# Altium schematic sheet ep4ce30_b.SchDoc: EP4CE30F23 - B
size OrCAD B; CheckedBy: liuchao; DrawnBy: liuchao; DocumentNumber: APEX-USB2; Revision: 3.0.0; SheetNumber: 2; SheetTotal: 9
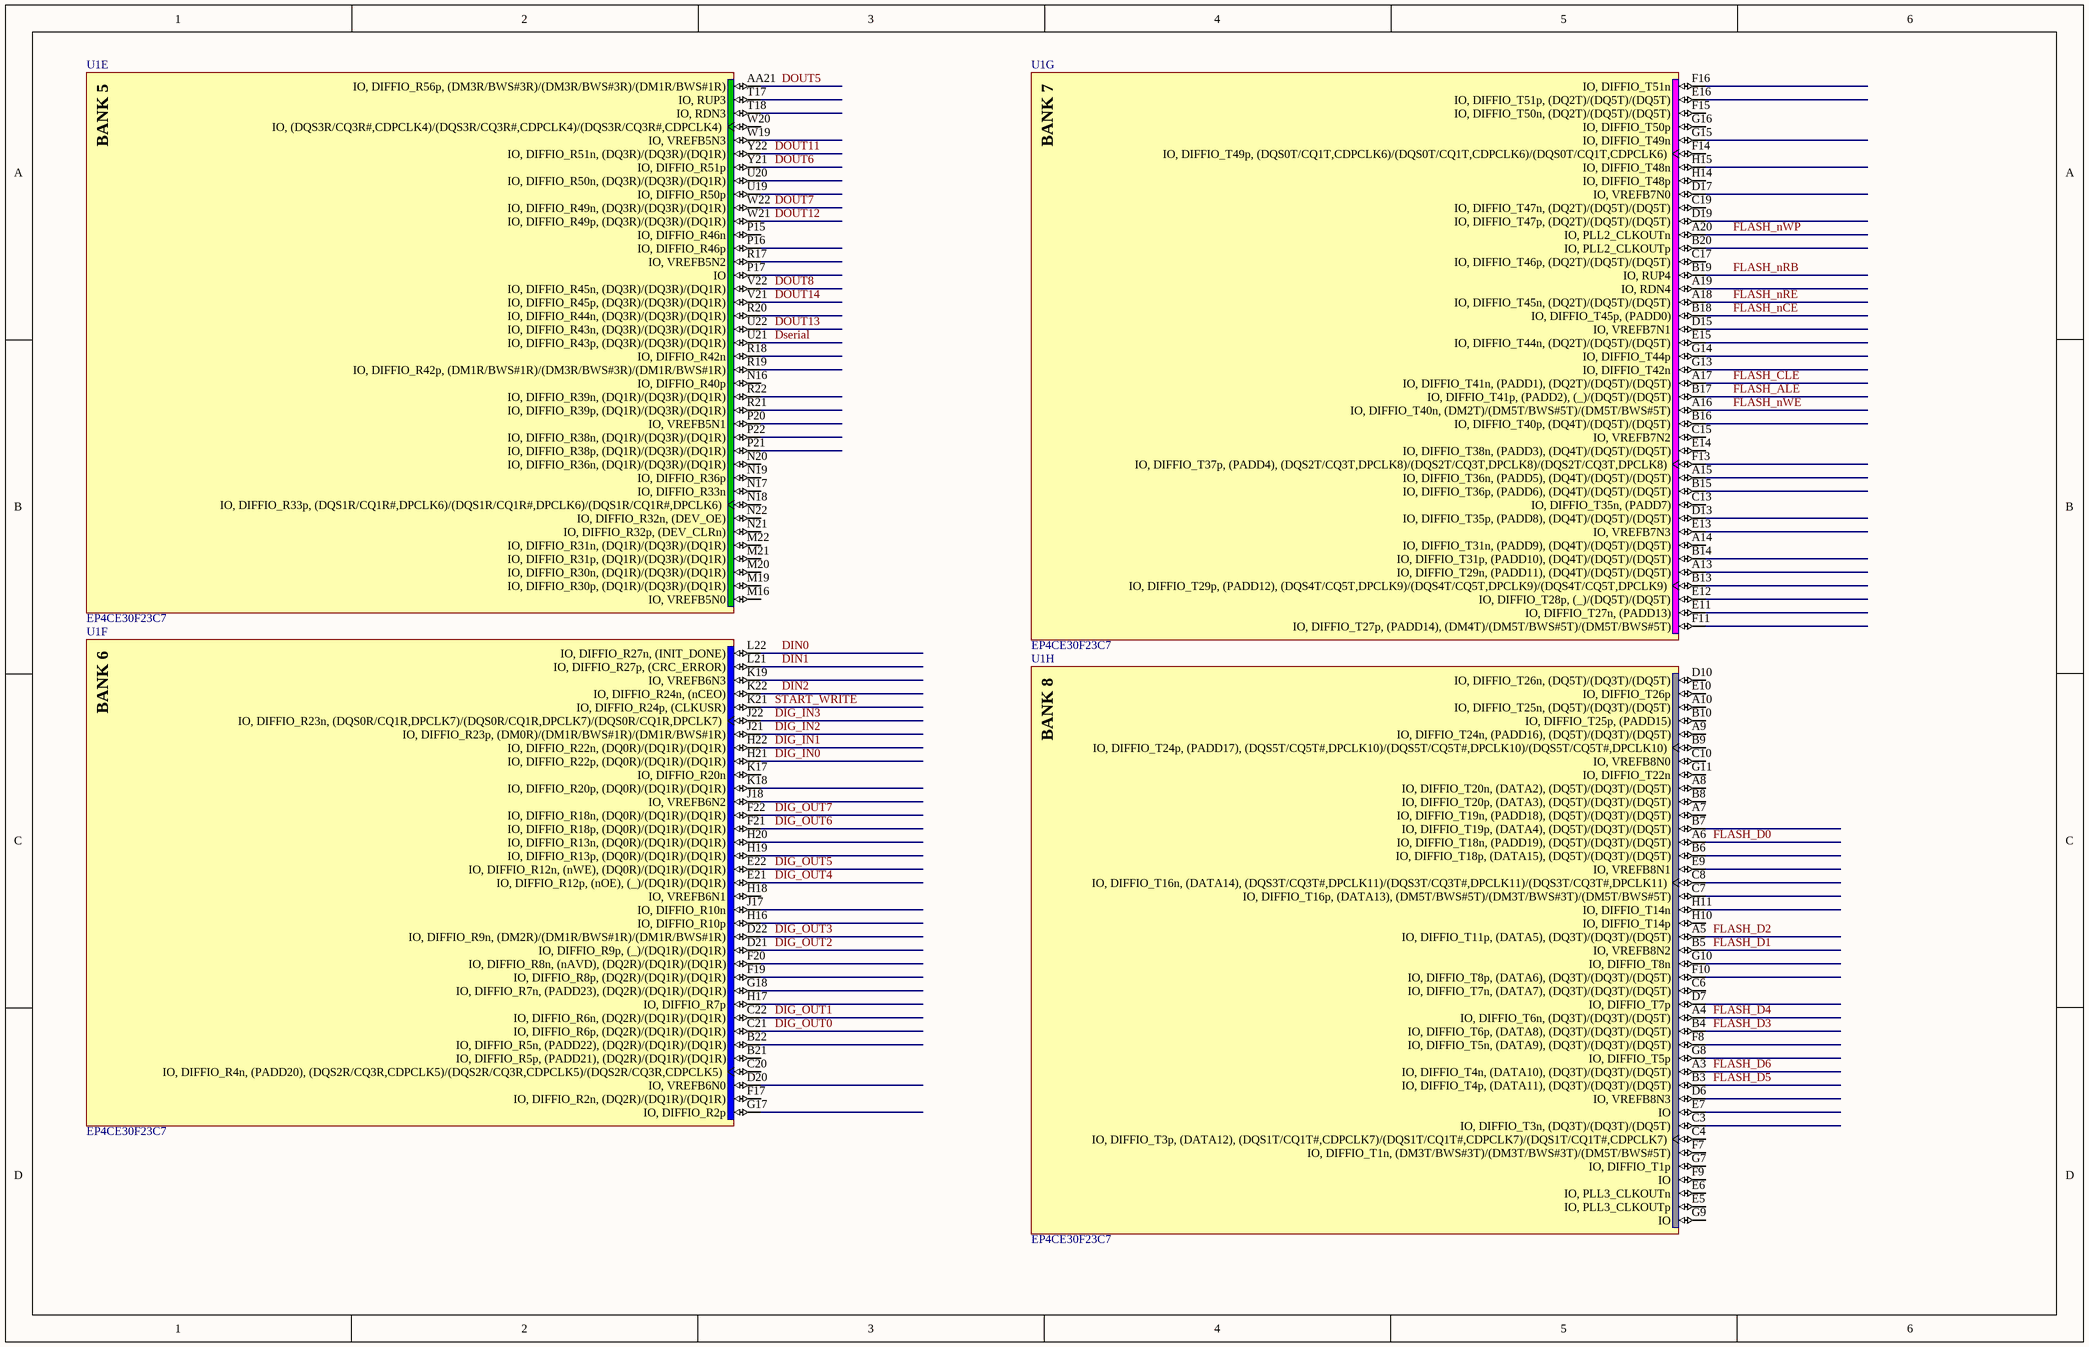
[diagram p0: ep4ce30_b.SchDoc]

## Parts
U1  EP4CE30F23C7  [FBGA484_A-240]  (parts E,F,G,H of 13)

## Nets
DIG_IN0: U1.H21(IO,_DIFFIO_R22p,_(DQ0R)/(DQ1R)/(DQ1R))
DIG_IN1: U1.H22(IO,_DIFFIO_R22n,_(DQ0R)/(DQ1R)/(DQ1R))
DIG_IN2: U1.J21(IO,_DIFFIO_R23p,_(DM0R)/(DM1R/BWS#1R)/(DM1R/BWS#1R))
DIG_IN3: U1.J22(IO,_DIFFIO_R23n,_(DQS0R/CQ1R,DPCLK7)/(DQS0R/CQ1R,DPCLK7)/(DQS0R/CQ1R,DPCLK7))
DIG_OUT0: U1.C21(IO,_DIFFIO_R6p,_(DQ2R)/(DQ1R)/(DQ1R))
DIG_OUT1: U1.C22(IO,_DIFFIO_R6n,_(DQ2R)/(DQ1R)/(DQ1R))
DIG_OUT2: U1.D21(IO,_DIFFIO_R9p,_(_)/(DQ1R)/(DQ1R))
DIG_OUT3: U1.D22(IO,_DIFFIO_R9n,_(DM2R)/(DM1R/BWS#1R)/(DM1R/BWS#1R))
DIG_OUT4: U1.E21(IO,_DIFFIO_R12p,_(nOE),_(_)/(DQ1R)/(DQ1R))
DIG_OUT5: U1.E22(IO,_DIFFIO_R12n,_(nWE),_(DQ0R)/(DQ1R)/(DQ1R))
DIG_OUT6: U1.F21(IO,_DIFFIO_R18p,_(DQ0R)/(DQ1R)/(DQ1R))
DIG_OUT7: U1.F22(IO,_DIFFIO_R18n,_(DQ0R)/(DQ1R)/(DQ1R))
DIN0: U1.L22(IO,_DIFFIO_R27n,_(INIT_DONE))
DIN1: U1.L21(IO,_DIFFIO_R27p,_(CRC_ERROR))
DIN2: U1.K22(IO,_DIFFIO_R24n,_(nCEO))
DOUT5: U1.AA21(IO,_DIFFIO_R56p,_(DM3R/BWS#3R)/(DM3R/BWS#3R)/(DM1R/BWS#1R))
DOUT6: U1.Y21(IO,_DIFFIO_R51p)
DOUT7: U1.W22(IO,_DIFFIO_R49n,_(DQ3R)/(DQ3R)/(DQ1R))
DOUT8: U1.V22(IO,_DIFFIO_R45n,_(DQ3R)/(DQ3R)/(DQ1R))
DOUT11: U1.Y22(IO,_DIFFIO_R51n,_(DQ3R)/(DQ3R)/(DQ1R))
DOUT12: U1.W21(IO,_DIFFIO_R49p,_(DQ3R)/(DQ3R)/(DQ1R))
DOUT13: U1.U22(IO,_DIFFIO_R43n,_(DQ3R)/(DQ3R)/(DQ1R))
DOUT14: U1.V21(IO,_DIFFIO_R45p,_(DQ3R)/(DQ3R)/(DQ1R))
Dserial: U1.U21(IO,_DIFFIO_R43p,_(DQ3R)/(DQ3R)/(DQ1R))
FLASH_ALE: U1.B17(IO,_DIFFIO_T41p,_(PADD2),_(_)/(DQ5T)/(DQ5T))
FLASH_CLE: U1.A17(IO,_DIFFIO_T41n,_(PADD1),_(DQ2T)/(DQ5T)/(DQ5T))
FLASH_D0: U1.A6(IO,_DIFFIO_T18n,_(PADD19),_(DQ5T)/(DQ3T)/(DQ5T))
FLASH_D1: U1.B5(IO,_VREFB8N2)
FLASH_D2: U1.A5(IO,_DIFFIO_T11p,_(DATA5),_(DQ3T)/(DQ3T)/(DQ5T))
FLASH_D3: U1.B4(IO,_DIFFIO_T6p,_(DATA8),_(DQ3T)/(DQ3T)/(DQ5T))
FLASH_D4: U1.A4(IO,_DIFFIO_T6n,_(DQ3T)/(DQ3T)/(DQ5T))
FLASH_D5: U1.B3(IO,_DIFFIO_T4p,_(DATA11),_(DQ3T)/(DQ3T)/(DQ5T))
FLASH_D6: U1.A3(IO,_DIFFIO_T4n,_(DATA10),_(DQ3T)/(DQ3T)/(DQ5T))
FLASH_nCE: U1.B18(IO,_DIFFIO_T45p,_(PADD0))
FLASH_nRB: U1.B19(IO,_RUP4)
FLASH_nRE: U1.A18(IO,_DIFFIO_T45n,_(DQ2T)/(DQ5T)/(DQ5T))
FLASH_nWE: U1.A16(IO,_DIFFIO_T40n,_(DM2T)/(DM5T/BWS#5T)/(DM5T/BWS#5T))
FLASH_nWP: U1.A20(IO,_PLL2_CLKOUTn)
START_WRITE: U1.K21(IO,_DIFFIO_R24p,_(CLKUSR))

Not connected (* = marked no-connect by the designer): U1 A7(IO,_DIFFIO_T19n,_(PADD18),_(DQ5T)/(DQ3T)/(DQ5T)) A8(IO,_DIFFIO_T20n,_(DATA2),_(DQ5T)/(DQ3T)/(DQ5T)) A9(IO,_DIFFIO_T24n,_(PADD16),_(DQ5T)/(DQ3T)/(DQ5T)) A10(IO,_DIFFIO_T25n,_(DQ5T)/(DQ3T)/(DQ5T)) A13(IO,_DIFFIO_T29n,_(PADD11),_(DQ4T)/(DQ5T)/(DQ5T)) A14(IO,_DIFFIO_T31n,_(PADD9),_(DQ4T)/(DQ5T)/(DQ5T)) A15(IO,_DIFFIO_T36n,_(PADD5),_(DQ4T)/(DQ5T)/(DQ5T)) A19(IO,_RDN4) B6(IO,_DIFFIO_T18p,_(DATA15),_(DQ5T)/(DQ3T)/(DQ5T)) B7(IO,_DIFFIO_T19p,_(DATA4),_(DQ5T)/(DQ3T)/(DQ5T)) B8(IO,_DIFFIO_T20p,_(DATA3),_(DQ5T)/(DQ3T)/(DQ5T)) B9(IO,_DIFFIO_T24p,_(PADD17),_(DQS5T/CQ5T#,DPCLK10)/(DQS5T/CQ5T#,DPCLK10)/(DQS5T/CQ5T#,DPCLK10)) B10(IO,_DIFFIO_T25p,_(PADD15)) B13(IO,_DIFFIO_T29p,_(PADD12),_(DQS4T/CQ5T,DPCLK9)/(DQS4T/CQ5T,DPCLK9)/(DQS4T/CQ5T,DPCLK9)) B14(IO,_DIFFIO_T31p,_(PADD10),_(DQ4T)/(DQ5T)/(DQ5T)) B15(IO,_DIFFIO_T36p,_(PADD6),_(DQ4T)/(DQ5T)/(DQ5T)) B16(IO,_DIFFIO_T40p,_(DQ4T)/(DQ5T)/(DQ5T)) B20(IO,_PLL2_CLKOUTp) B21(IO,_DIFFIO_R5p,_(PADD21),_(DQ2R)/(DQ1R)/(DQ1R)) B22(IO,_DIFFIO_R5n,_(PADD22),_(DQ2R)/(DQ1R)/(DQ1R)) C3(IO,_DIFFIO_T3n,_(DQ3T)/(DQ3T)/(DQ5T)) C4(IO,_DIFFIO_T3p,_(DATA12),_(DQS1T/CQ1T#,CDPCLK7)/(DQS1T/CQ1T#,CDPCLK7)/(DQS1T/CQ1T#,CDPCLK7)) C6(IO,_DIFFIO_T7n,_(DATA7),_(DQ3T)/(DQ3T)/(DQ5T)) C7(IO,_DIFFIO_T16p,_(DATA13),_(DM5T/BWS#5T)/(DM3T/BWS#3T)/(DM5T/BWS#5T)) C8(IO,_DIFFIO_T16n,_(DATA14),_(DQS3T/CQ3T#,DPCLK11)/(DQS3T/CQ3T#,DPCLK11)/(DQS3T/CQ3T#,DPCLK11)) C10(IO,_VREFB8N0) C13(IO,_DIFFIO_T35n,_(PADD7)) C15(IO,_VREFB7N2) C17(IO,_DIFFIO_T46p,_(DQ2T)/(DQ5T)/(DQ5T)) C19(IO,_DIFFIO_T47n,_(DQ2T)/(DQ5T)/(DQ5T)) C20(IO,_DIFFIO_R4n,_(PADD20),_(DQS2R/CQ3R,CDPCLK5)/(DQS2R/CQ3R,CDPCLK5)/(DQS2R/CQ3R,CDPCLK5)) D6(IO,_VREFB8N3) D7(IO,_DIFFIO_T7p) D10(IO,_DIFFIO_T26n,_(DQ5T)/(DQ3T)/(DQ5T)) D13(IO,_DIFFIO_T35p,_(PADD8),_(DQ4T)/(DQ5T)/(DQ5T)) D15(IO,_VREFB7N1) D17(IO,_VREFB7N0) D19(IO,_DIFFIO_T47p,_(DQ2T)/(DQ5T)/(DQ5T)) D20(IO,_VREFB6N0) E5(IO,_PLL3_CLKOUTp) E6(IO,_PLL3_CLKOUTn) E7(IO) E9(IO,_VREFB8N1) E10(IO,_DIFFIO_T26p) E11(IO,_DIFFIO_T27n,_(PADD13)) E12(IO,_DIFFIO_T28p,_(_)/(DQ5T)/(DQ5T)) E13(IO,_VREFB7N3) E14(IO,_DIFFIO_T38n,_(PADD3),_(DQ4T)/(DQ5T)/(DQ5T)) E15(IO,_DIFFIO_T44n,_(DQ2T)/(DQ5T)/(DQ5T)) E16(IO,_DIFFIO_T51p,_(DQ2T)/(DQ5T)/(DQ5T)) F7(IO,_DIFFIO_T1n,_(DM3T/BWS#3T)/(DM3T/BWS#3T)/(DM5T/BWS#5T)) F8(IO,_DIFFIO_T5n,_(DATA9),_(DQ3T)/(DQ3T)/(DQ5T)) F9(IO) F10(IO,_DIFFIO_T8p,_(DATA6),_(DQ3T)/(DQ3T)/(DQ5T)) F11(IO,_DIFFIO_T27p,_(PADD14),_(DM4T)/(DM5T/BWS#5T)/(DM5T/BWS#5T)) F13(IO,_DIFFIO_T37p,_(PADD4),_(DQS2T/CQ3T,DPCLK8)/(DQS2T/CQ3T,DPCLK8)/(DQS2T/CQ3T,DPCLK8)) F14(IO,_DIFFIO_T49p,_(DQS0T/CQ1T,CDPCLK6)/(DQS0T/CQ1T,CDPCLK6)/(DQS0T/CQ1T,CDPCLK6)) F15(IO,_DIFFIO_T50n,_(DQ2T)/(DQ5T)/(DQ5T)) F16(IO,_DIFFIO_T51n) F17(IO,_DIFFIO_R2n,_(DQ2R)/(DQ1R)/(DQ1R)) F19(IO,_DIFFIO_R8p,_(DQ2R)/(DQ1R)/(DQ1R)) F20(IO,_DIFFIO_R8n,_(nAVD),_(DQ2R)/(DQ1R)/(DQ1R)) G7(IO,_DIFFIO_T1p) G8(IO,_DIFFIO_T5p) G9(IO) G10(IO,_DIFFIO_T8n) G11(IO,_DIFFIO_T22n) G13(IO,_DIFFIO_T42n) G14(IO,_DIFFIO_T44p) G15(IO,_DIFFIO_T49n) G16(IO,_DIFFIO_T50p) G17(IO,_DIFFIO_R2p) G18(IO,_DIFFIO_R7n,_(PADD23),_(DQ2R)/(DQ1R)/(DQ1R)) H10(IO,_DIFFIO_T14p) H11(IO,_DIFFIO_T14n) H14(IO,_DIFFIO_T48p) H15(IO,_DIFFIO_T48n) H16(IO,_DIFFIO_R10p) H17(IO,_DIFFIO_R7p) H18(IO,_VREFB6N1) H19(IO,_DIFFIO_R13p,_(DQ0R)/(DQ1R)/(DQ1R)) H20(IO,_DIFFIO_R13n,_(DQ0R)/(DQ1R)/(DQ1R)) J17(IO,_DIFFIO_R10n) J18(IO,_VREFB6N2) K17(IO,_DIFFIO_R20n) K18(IO,_DIFFIO_R20p,_(DQ0R)/(DQ1R)/(DQ1R)) K19(IO,_VREFB6N3) M16(IO,_VREFB5N0) M19(IO,_DIFFIO_R30p,_(DQ1R)/(DQ3R)/(DQ1R)) M20(IO,_DIFFIO_R30n,_(DQ1R)/(DQ3R)/(DQ1R)) M21(IO,_DIFFIO_R31p,_(DQ1R)/(DQ3R)/(DQ1R)) M22(IO,_DIFFIO_R31n,_(DQ1R)/(DQ3R)/(DQ1R)) N16(IO,_DIFFIO_R40p) N17(IO,_DIFFIO_R33n) N18(IO,_DIFFIO_R33p,_(DQS1R/CQ1R#,DPCLK6)/(DQS1R/CQ1R#,DPCLK6)/(DQS1R/CQ1R#,DPCLK6)) N19(IO,_DIFFIO_R36p) N20(IO,_DIFFIO_R36n,_(DQ1R)/(DQ3R)/(DQ1R)) N21(IO,_DIFFIO_R32p,_(DEV_CLRn)) N22(IO,_DIFFIO_R32n,_(DEV_OE)) P15(IO,_DIFFIO_R46n) P16(IO,_DIFFIO_R46p) P17(IO) P20(IO,_VREFB5N1) P21(IO,_DIFFIO_R38p,_(DQ1R)/(DQ3R)/(DQ1R)) P22(IO,_DIFFIO_R38n,_(DQ1R)/(DQ3R)/(DQ1R)) R17(IO,_VREFB5N2) R18(IO,_DIFFIO_R42n) R19(IO,_DIFFIO_R42p,_(DM1R/BWS#1R)/(DM3R/BWS#3R)/(DM1R/BWS#1R)) R20(IO,_DIFFIO_R44n,_(DQ3R)/(DQ3R)/(DQ1R)) R21(IO,_DIFFIO_R39p,_(DQ1R)/(DQ3R)/(DQ1R)) R22(IO,_DIFFIO_R39n,_(DQ1R)/(DQ3R)/(DQ1R)) T17(IO,_RUP3) T18(IO,_RDN3) U19(IO,_DIFFIO_R50p) U20(IO,_DIFFIO_R50n,_(DQ3R)/(DQ3R)/(DQ1R)) W19(IO,_VREFB5N3) W20(IO,_(DQS3R/CQ3R#,CDPCLK4)/(DQS3R/CQ3R#,CDPCLK4)/(DQS3R/CQ3R#,CDPCLK4))

## Notes on the sheet
- (in symbol EP4CE30F23C7, part E) BANK 5
- (in symbol EP4CE30F23C7, part F) BANK 6
- (in symbol EP4CE30F23C7, part G) BANK 7
- (in symbol EP4CE30F23C7, part H) BANK 8

## Library data of the parts
U1 = EP4CE30F23C7: Cyclone IV Family FPGA, 1.2V Core, 328 I/O Pins, 4 PLLs, 484-Pin FBGA, Speed Grade 7, Commercial Grade; Manufacturer: Altera; DatasheetVersion: ver1.6, Nov-2011; PackageVersion: ver1.0, Jun-2011; PackageReference: FBGA484_A-240; PackageDescription: 484-Pin FineLine Ball Grid Array (FBGA) - Wire Bond - A:2.40; Code_JEDEC: MS-034-AAJ-1; ComponentLink1Description: Manufacturer URL; ComponentLink1URL: http://www.altera.com/; ComponentLink2Description: Handbook; ComponentLink2URL: http://www.altera.com/literature/hb/cyclone-iv/cyclone4-handbook.pdf; ComponentLink3Description: Pinout; ComponentLink3URL: http://www.altera.com/literature/lit-dp.jsp?category=cyc%204&showspreadsheet=y; ComponentLink4Description: Package Specification; ComponentLink4URL: http://www.altera.com/devicepackaging/04R00247-02.pdf